# EAGLE design ft231x-micro (EAGLE 7.0.0)
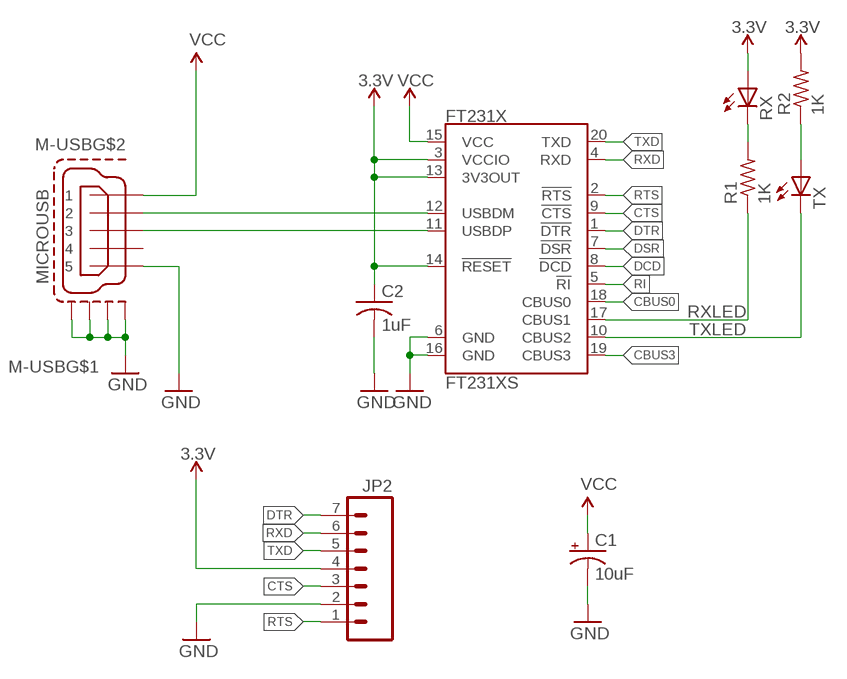
[diagram p0: schematic, sheet 1]

## Parts
C1  10uF  CAP_POL1206  [EIA3216]
C2  1uF  C-USC0805  [C0805]
FT231X  FT231XS  [SSOP20_L]
JP2  M07  [1X07]
M-USB  MICROUSB  MICRO-USB-SHIELD-ZX62R-B-5P  [ZX62R-B-5P]
R1  1K  R-US_R0603  [R0603]
R2  1K  R-US_R0603  [R0603]
RX  LEDCHIP-LED0805  [CHIP-LED0805]
TX  LEDCHIP-LED0805  [CHIP-LED0805]

## Nets
3.3V [PWR]: C2.1 FT231X.3(VCCIO) FT231X.13(3V3OUT) FT231X.14(!RESET) JP2.4 R2.2 RX.A
CBUS0: FT231X.18(CBUS0)
CBUS3: FT231X.19(CBUS3)
CTS: FT231X.9(!CTS) JP2.3
DCD: FT231X.8(!DCD)
DSR: FT231X.7(!DSR)
DTR: FT231X.1(!DTR) JP2.7
GND [PWR]: C1.C(-) C2.2 FT231X.6(GND) FT231X.16(GND) JP2.2 M-USB.5 M-USB.M1(S1) M-USB.M2(S2) M-USB.M3(S3) M-USB.M4(S4)
N$1: R2.1 TX.A
N$3: FT231X.11(USBDP) M-USB.3
N$4: FT231X.12(USBDM) M-USB.2
N$6: R1.2 RX.C
RI: FT231X.5(!RI)
RTS: FT231X.2(!RTS) JP2.1
RXD: FT231X.4(RXD) JP2.6
RXLED: FT231X.17(CBUS1) R1.1
TXD: FT231X.20(TXD) JP2.5
TXLED: FT231X.10(CBUS2) TX.C
VCC [PWR]: C1.A(+) FT231X.15(VCC) M-USB.1
Unconnected: M-USB.4

## Library data of the parts
C1 = SparkFun-Passives:CAP_POL: Capacitor Polarized These are standard SMD and PTH capacitors. Normally 10uF, 47uF, and 100uF in electrolytic and tantalum varieties. Always verify the external diameter of the through hole cap, it varies with capacity, voltage, and manufacturer. The EIA devices should be standard.
C2 = adafruit:C-US: CAPACITOR, American symbol
FT231X = SparkFun-DigitalIC:FT231X: FTDI FT231X Full Speed USB to Full-handshake UART This USB2.0 Full Speed IC offers a compact bridge to full handshake UART interfaces. The device is a UART, capable of operating up to 3MBaud, with low power consumption (8mA). The FT231X includes the complete FT-X series feature set and enables USB to be added into a system design quickly and easily over a UART interface.
JP2 = SparkFun-Connectors:M07: Header 7 Standard 7-pin 0.1" header. Use with straight break away headers (SKU : PRT-00116), right angle break away headers (PRT-00553), swiss pins (PRT-00743), machine pins (PRT-00117), and female headers (PRT-00115). NOTES ON THE VARIANTS LOCK and LOCK_LONGPADS... This footprint was designed to help hold the alignment of a through-hole component (i.e. 7-pin header) while soldering it into place. You may notice that each hole has been shifted either up or down by 0.005 of an inch from it's more standard position (which is usually a perfectly straight line). This slight alteration caused the pins (the squares in the middle) to touch the edges of the holes. Because they are alternating, it causes a "brace" to hold the header in place. 0.005 has proven to be the perfect amount of "off-center" position when using our standard breakaway headers. Although looks a little odd when you look at the bare footprint, once you have a header in there, the alteration is very hard to notice. Also, if you push a header all the way into place, it is covered up entirely on the bottom side. This idea of altering the position of holes to aid alignment will be further integrated into the Sparkfun Library for other footprints. It can help hold any component with 3 or more connection pins.
M-USB = con-hirose:MICRO-USB-SHIELD-: Hirose Micro USB Connector ZX62R-B-5P: Micro B, reverse (top mount) shell SMT Supplier: DigiKey H11574CT-ND Source: http://www.hirose.co.jp/cataloge_hp/e24200011.pdf
R1 R2 = adafruit-2:R-US_: RESISTOR, American symbol
RX TX = adafruit-2:LED: LED OSRAM: - CHIPLED LG R971, LG N971, LY N971, LG Q971, LY Q971, LO R971, LY R971 LH N974, LH R974 LS Q976, LO Q976, LY Q976 LO Q996 - Hyper CHIPLED LW Q18S LB Q993, LB Q99A, LB R99A - SideLED LS A670, LO A670, LY A670, LG A670, LP A670 LB A673, LV A673, LT A673, LW A673 LH A674 LY A675 LS A676, LA A676, LO A676, LY A676, LW A676 LS A679, LY A679, LG A679 - Hyper Micro SIDELED® LS Y876, LA Y876, LO Y876, LY Y876 LT Y87S - SmartLED LW L88C, LW L88S LB L89C, LB L89S, LG L890 LS L89K, LO L89K, LY L89K LS L896, LA L896, LO L896, LY L896 - TOPLED LS T670, LO T670, LY T670, LG T670, LP T670 LSG T670, LSP T670, LSY T670, LOP T670, LYG T670 LG T671, LOG T671, LSG T671 LB T673, LV T673, LT T673, LW T673 LH T674 LS T676, LA T676, LO T676, LY T676, LB T676, LH T676, LSB T676, LW T676 LB T67C, LV T67C, LT T67C, LS T67K, LO T67K, LY T67K, LW E67C LS E67B, LA E67B, LO E67B, LY E67B, LB E67C, LV E67C, LT E67C LW T67C LS T679, LY T679, LG T679 LS T770, LO T770, LY T770, LG T770, LP T770 LB T773, LV T773, LT T773, LW T773 LH T774 LS E675, LA E675, LY E675, LS T675 LS T776, LA T776, LO T776, LY T776, LB T776 LHGB T686 LT T68C, LB T68C - Hyper Mini TOPLED® LB M676 - Mini TOPLED Santana® LG M470 LS M47K, LO M47K, LY M47K Source: http://www.osram.convergy.de/

## Net classes
0 default: width 0.305 mm
1 PWR: width 0.457 mm

## Board
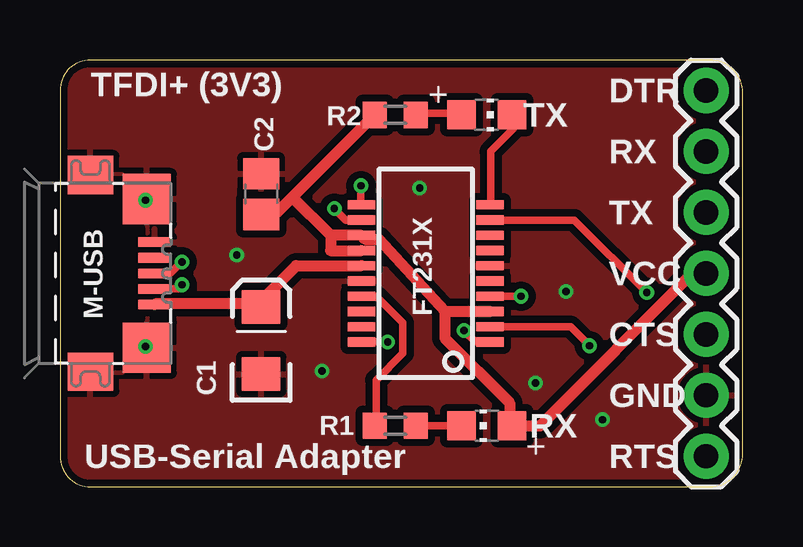
[diagram p1: board, top side]
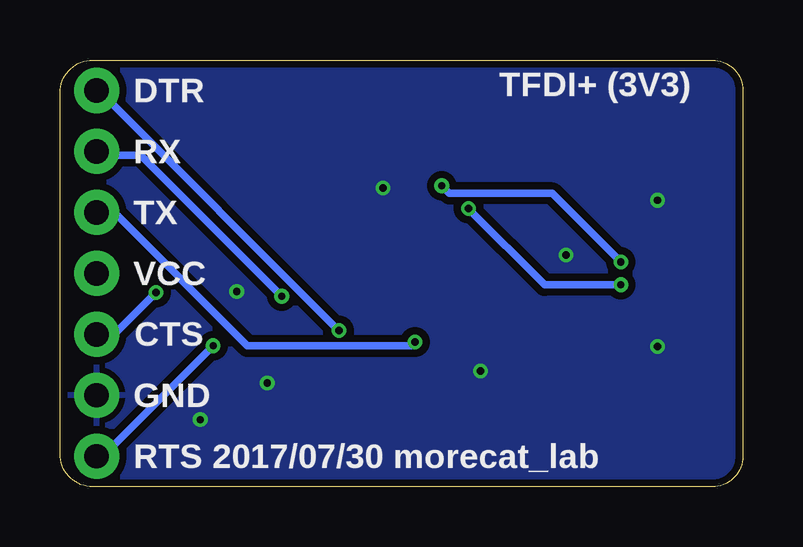
[diagram p2: board, bottom side, seen from below]

Size 28.45 x 17.78 mm. Coordinates in mm from the lower left corner, seen from the top.
Outline: 0,16.51 0,1.27 arc90 1.27,0 27.08,0 arc90 28.45,1.37 28.45,16.41 arc90 27.08,17.78 1.27,17.78 arc90 0,16.51
Copper layers (1*16): Top 0.035mm / dielectric 1.5mm / Bottom 0.035mm
Design rules "Elecrow_2-layer_eagle_rule": minimum track width 6mil, minimum drill 12mil, track to track 6mil, track to pad 6mil, pad to pad 6mil, via to via 6mil, smd to smd 0mil, copper to edge 10mil, drill to drill 10mil, minimum pad ring 10mil, minimum via ring 6mil, stop-mask expansion 2mil, vias tented up to drill 100mil, thermal gap 10mil

### Footprints (pad centres in the part's own frame; a part is rotated, then mirrored left to right if it is on the bottom)
EIA3216 = smd 1.4 x 1.6: A 1.4,0; C -1.4,0
C0805 = smd 1.3 x 1.5: 1 -0.85,0; 2 0.85,0
SSOP20_L = smd 0.381 x 1.143: 1 -2.857,-2.68; 2 -2.223,-2.68; 3 -1.587,-2.68; 4 -0.953,-2.68; 5 -0.318,-2.68; 6 0.318,-2.68; 7 0.953,-2.68; 8 1.587,-2.68; 9 2.223,-2.68; 10 2.857,-2.68; 11 2.857,2.68; 12 2.223,2.68; 13 1.587,2.68; 14 0.953,2.68; 15 0.318,2.68; 16 -0.318,2.68; 17 -0.953,2.68; 18 -1.587,2.68; 19 -2.223,2.68; 20 -2.857,2.68
1X07 = drill 1.016 pad 1.88: 1 0,0; 2 2.54,0; 3 5.08,0; 4 7.62,0; 5 10.16,0; 6 12.7,0; 7 15.24,0
ZX62R-B-5P = smd 1.35 x 0.4: 1 2.675,-1.3; 2 2.675,-0.65; 3 2.675,0; 4 2.675,0.65; 5 2.675,1.3 | smd 1.9 x 1.6: M1 0,-4.1; M2 0,4.1 | smd 2 x 2.1: M3 2.35,3.1; M4 2.35,-3.1
R0603 = smd 1 x 1.1: 1 -0.85,0; 2 0.85,0
CHIP-LED0805 = smd 1.2 x 1.2: A 0,-1.05; C 0,1.05

### Placement (x,y rotation side)
C1  8.38,6.1 90 top
C2  8.38,12.19 90 top
FT231X  15.24,8.89 90 top
JP2  26.92,1.27 90 top
M-USB  1.27,8.89 0 top
R1  13.97,2.54 0 top
R2  13.97,15.49 180 top
RX  17.78,2.54 90 top
TX  17.78,15.49 270 top

### Tracks (layer width: path | path; a pad name or v marks a point on that pad's centre or on a via)
3.3V
  Top 0.457: 9.68,12.06 9.05,11.43 8.41,11.43 C2.1 | 9.68,12.06 13.02,15.4 R2.2 | 11.27,10.48 11.27,9.84 FT231X.14 | 16.03,7.3 FT231X.3 | 16.03,7.3 13.27,10.32 12.7,10.32 FT231X.13 11.27,10.48 | 16.03,7.3 16.03,6.19 18.73,3.49 18.73,2.54 RX.A 20,2.54 26.35,8.89 JP2.4 | 11.27,10.48 9.68,12.06
CTS  (via drill 0.3)
  Top 0.305: FT231X.9 21.43,11.11 v24.45,8.1
  Bottom 0.305: v24.45,8.1 26.19,6.35 JP2.3
DTR  (via drill 0.3)
  Top 0.305: FT231X.1 17.3,6.03 v16.83,6.51
  Bottom 0.305: v16.83,6.51 26.83,16.51 JP2.7
GND  (via drill 0.3)
  other vias: 3.56,5.84 3.56,11.94 19.81,4.32 14.99,12.45 10.92,4.83 22.61,2.79 7.37,9.65 21.08,8.13
  pour Top (isolate 0.305): 0,17.78 0,0 29.72,0 29.72,17.78
  pour Bottom (isolate 0.305): 30.99,19.05 0,19.05 0,0 30.99,0
N$1
  Top 0.305: R2.1 14.92,15.56 16.67,15.56 TX.A
N$3  (via drill 0.3)
  Top 0.305: v12.54,12.54 12.54,11.75 FT231X.11 | v5.08,9.37 4.6,8.89 M-USB.3
  Bottom 0.305: v12.54,12.54 12.22,12.22 7.94,12.22 v5.08,9.37
N$4  (via drill 0.3)
  Top 0.305: FT231X.12 11.91,11.11 v11.43,11.59 | v5.08,8.41 4.92,8.26 3.97,8.26 M-USB.2
  Bottom 0.305: v11.43,11.59 8.26,8.41 v5.08,8.41
N$6
  Top 0.305: RX.C R1.2
RTS  (via drill 0.3)
  Top 0.305: FT231X.2 21.27,6.67 v22.07,5.87
  Bottom 0.305: v22.07,5.87 26.67,1.27 JP2.1
RXD  (via drill 0.3)
  Top 0.305: v19.21,7.94 FT231X.4
  Bottom 0.305: v19.21,7.94 25.08,13.81 26.67,13.81 26.83,13.97 JP2.6
RXLED
  Top 0.305: FT231X.17 13.18,7.94 14.29,6.83 14.29,5.56 13.18,4.45 13.18,2.54 R1.1
TXD  (via drill 0.3)
  Top 0.305: v13.65,6.03 FT231X.20
  Bottom 0.305: v13.65,6.03 13.81,5.87 20.64,5.87 26.19,11.43 JP2.5
TXLED
  Top 0.305: FT231X.10 17.94,11.75 17.94,13.97 18.89,14.92 18.89,15.4 TX.C
VCC
  Top 0.457: FT231X.15 9.84,9.21 8.26,7.62 C1.A 8.1,7.62 3.97,7.62 M-USB.1

### Text on the board
tNames: DTR | TFDI+ (3V3) | RX | TX | VCC | CTS | GND | USB-Serial Adapter | RTS
bNames: DTR | TFDI+ (3V3) | RX | TX | VCC | CTS | GND | 2017/07/30 morecat_lab | RTS